# Altium project Altera_Array.PrjPCB
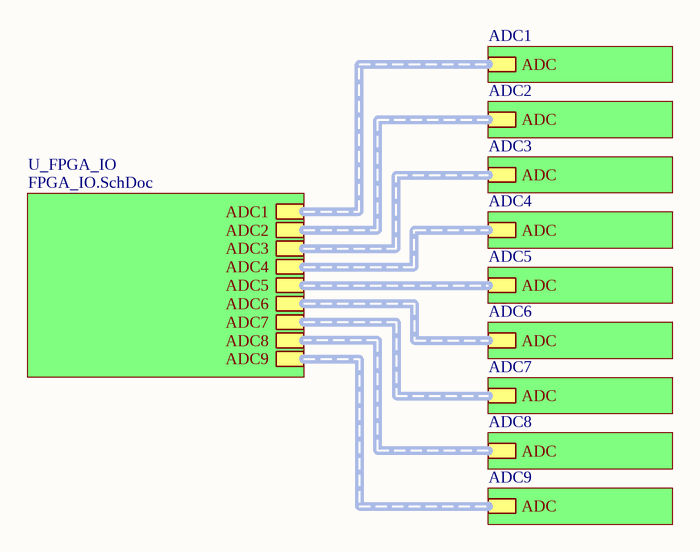
[diagram p0: Altera_Array_TOP.SchDoc]
3 sheets, 28 parts. Net scope: hierarchical (ports join the sheet entries above them; power ports are global).
Board file: Altera_Array.PcbDoc
Sheets:
  Altera_Array_TOP.SchDoc
    ADC1 = ADC_Connector.SchDoc
    ADC2 = ADC_Connector.SchDoc
    ADC3 = ADC_Connector.SchDoc
    ADC4 = ADC_Connector.SchDoc
    ADC5 = ADC_Connector.SchDoc
    ADC6 = ADC_Connector.SchDoc
    ADC7 = ADC_Connector.SchDoc
    ADC8 = ADC_Connector.SchDoc
    ADC9 = ADC_Connector.SchDoc
    U_FPGA_IO = FPGA_IO.SchDoc

## Sheet Altera_Array_TOP.SchDoc
size A

### Sub-sheets
ADC1 = ADC_Connector.SchDoc: ADC (harness ADC)
ADC2 = ADC_Connector.SchDoc: ADC (harness ADC)
ADC3 = ADC_Connector.SchDoc: ADC (harness ADC)
ADC4 = ADC_Connector.SchDoc: ADC (harness ADC)
ADC5 = ADC_Connector.SchDoc: ADC (harness ADC)
ADC6 = ADC_Connector.SchDoc: ADC (harness ADC)
ADC7 = ADC_Connector.SchDoc: ADC (harness ADC)
ADC8 = ADC_Connector.SchDoc: ADC (harness ADC)
ADC9 = ADC_Connector.SchDoc: ADC (harness ADC)
U_FPGA_IO = FPGA_IO.SchDoc: ADC1 (harness ADC), ADC4 (harness ADC), ADC8 (harness ADC), ADC5 (harness ADC), ADC9 (harness ADC), ADC2 (harness ADC), ADC3 (harness ADC), ADC7 (harness ADC), ADC6 (harness ADC)

### Buses and harness runs
harness sheet ADC1/ADC = sheet U_FPGA_IO/ADC1
harness sheet ADC2/ADC = sheet U_FPGA_IO/ADC2
harness sheet ADC3/ADC = sheet U_FPGA_IO/ADC3
harness sheet ADC4/ADC = sheet U_FPGA_IO/ADC4
harness sheet ADC5/ADC = sheet U_FPGA_IO/ADC5
harness sheet ADC6/ADC = sheet U_FPGA_IO/ADC6
harness sheet ADC7/ADC = sheet U_FPGA_IO/ADC7
harness sheet ADC8/ADC = sheet U_FPGA_IO/ADC8
harness sheet ADC9/ADC = sheet U_FPGA_IO/ADC9

## Sheet ADC_Connector.SchDoc
size A
Used 9 times, as channels ADC1, ADC2, ADC3, ADC4, ADC5, ADC6, ADC7, ADC8, ADC9. Parts and nets are listed once, with the designators drawn on the sheet.
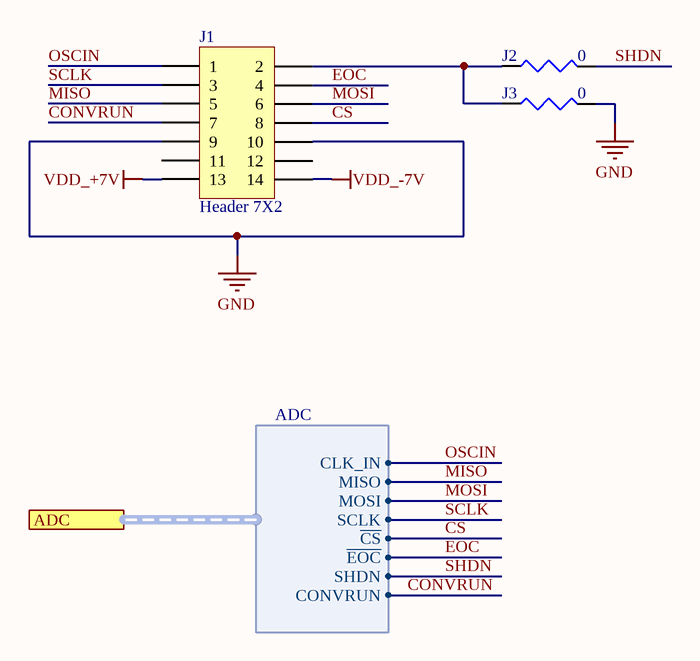
[diagram p1: ADC_Connector.SchDoc]

### Parts
J1  Header 7X2  [FLE-107-01-G-DV-A-TR]
J2  value 0  [J1-0603]  (hidden comment: Res3)
J3  value 0  [J1-0603]  (hidden comment: Res3)

### Ports
ADC (harness ADC)

### Harnesses
ADC: CLK_IN, MISO, MOSI, SCLK, ~{CS}, ~{EOC}, SHDN, CONVRUN

### Nets
GND: J1.9 J1.10 J3.2
VDD_+7V: J1.13
VDD_-7V: J1.14
~{CS}: J1.8 ; port ADC.~{CS}
CONVRUN: J1.7 ; port ADC.CONVRUN
~{EOC}: J1.4 ; port ADC.~{EOC}
MISO: J1.5 ; port ADC.MISO
MOSI: J1.6 ; port ADC.MOSI
OSCIN: J1.1 ; port ADC.CLK_IN
SCLK: J1.3 ; port ADC.SCLK
SHDN: J2.2 ; port ADC.SHDN
NetJ1_2: J1.2 J2.1 J3.1

Not connected (* = marked no-connect by the designer): J1 11 12

### Channels
ADC1: designators end in .A
ADC2: designators end in .B
ADC3: designators end in .C
ADC4: designators end in .D
ADC5: designators end in .E
ADC6: designators end in .F
ADC7: designators end in .G
ADC8: designators end in .H
ADC9: designators end in .I

### Library data of the parts
J1 = Header 7X2: Header, 7-Pin, Dual row; LatestRevisionDate: 17-Jul-2002; LatestRevisionNote: Re-released for DXP Platform.; Publisher: Altium Limited
J2 J3 = Res3: Resistor; Published: 8-Jun-2000; LatestRevisionDate: 29-May-2009; LatestRevisionNote: IPC-7351 Footprint Added.; PackageReference: J1-0603; Publisher: Altium Limited; PackageDescription: Chip Resistor

## Sheet FPGA_IO.SchDoc
size A2
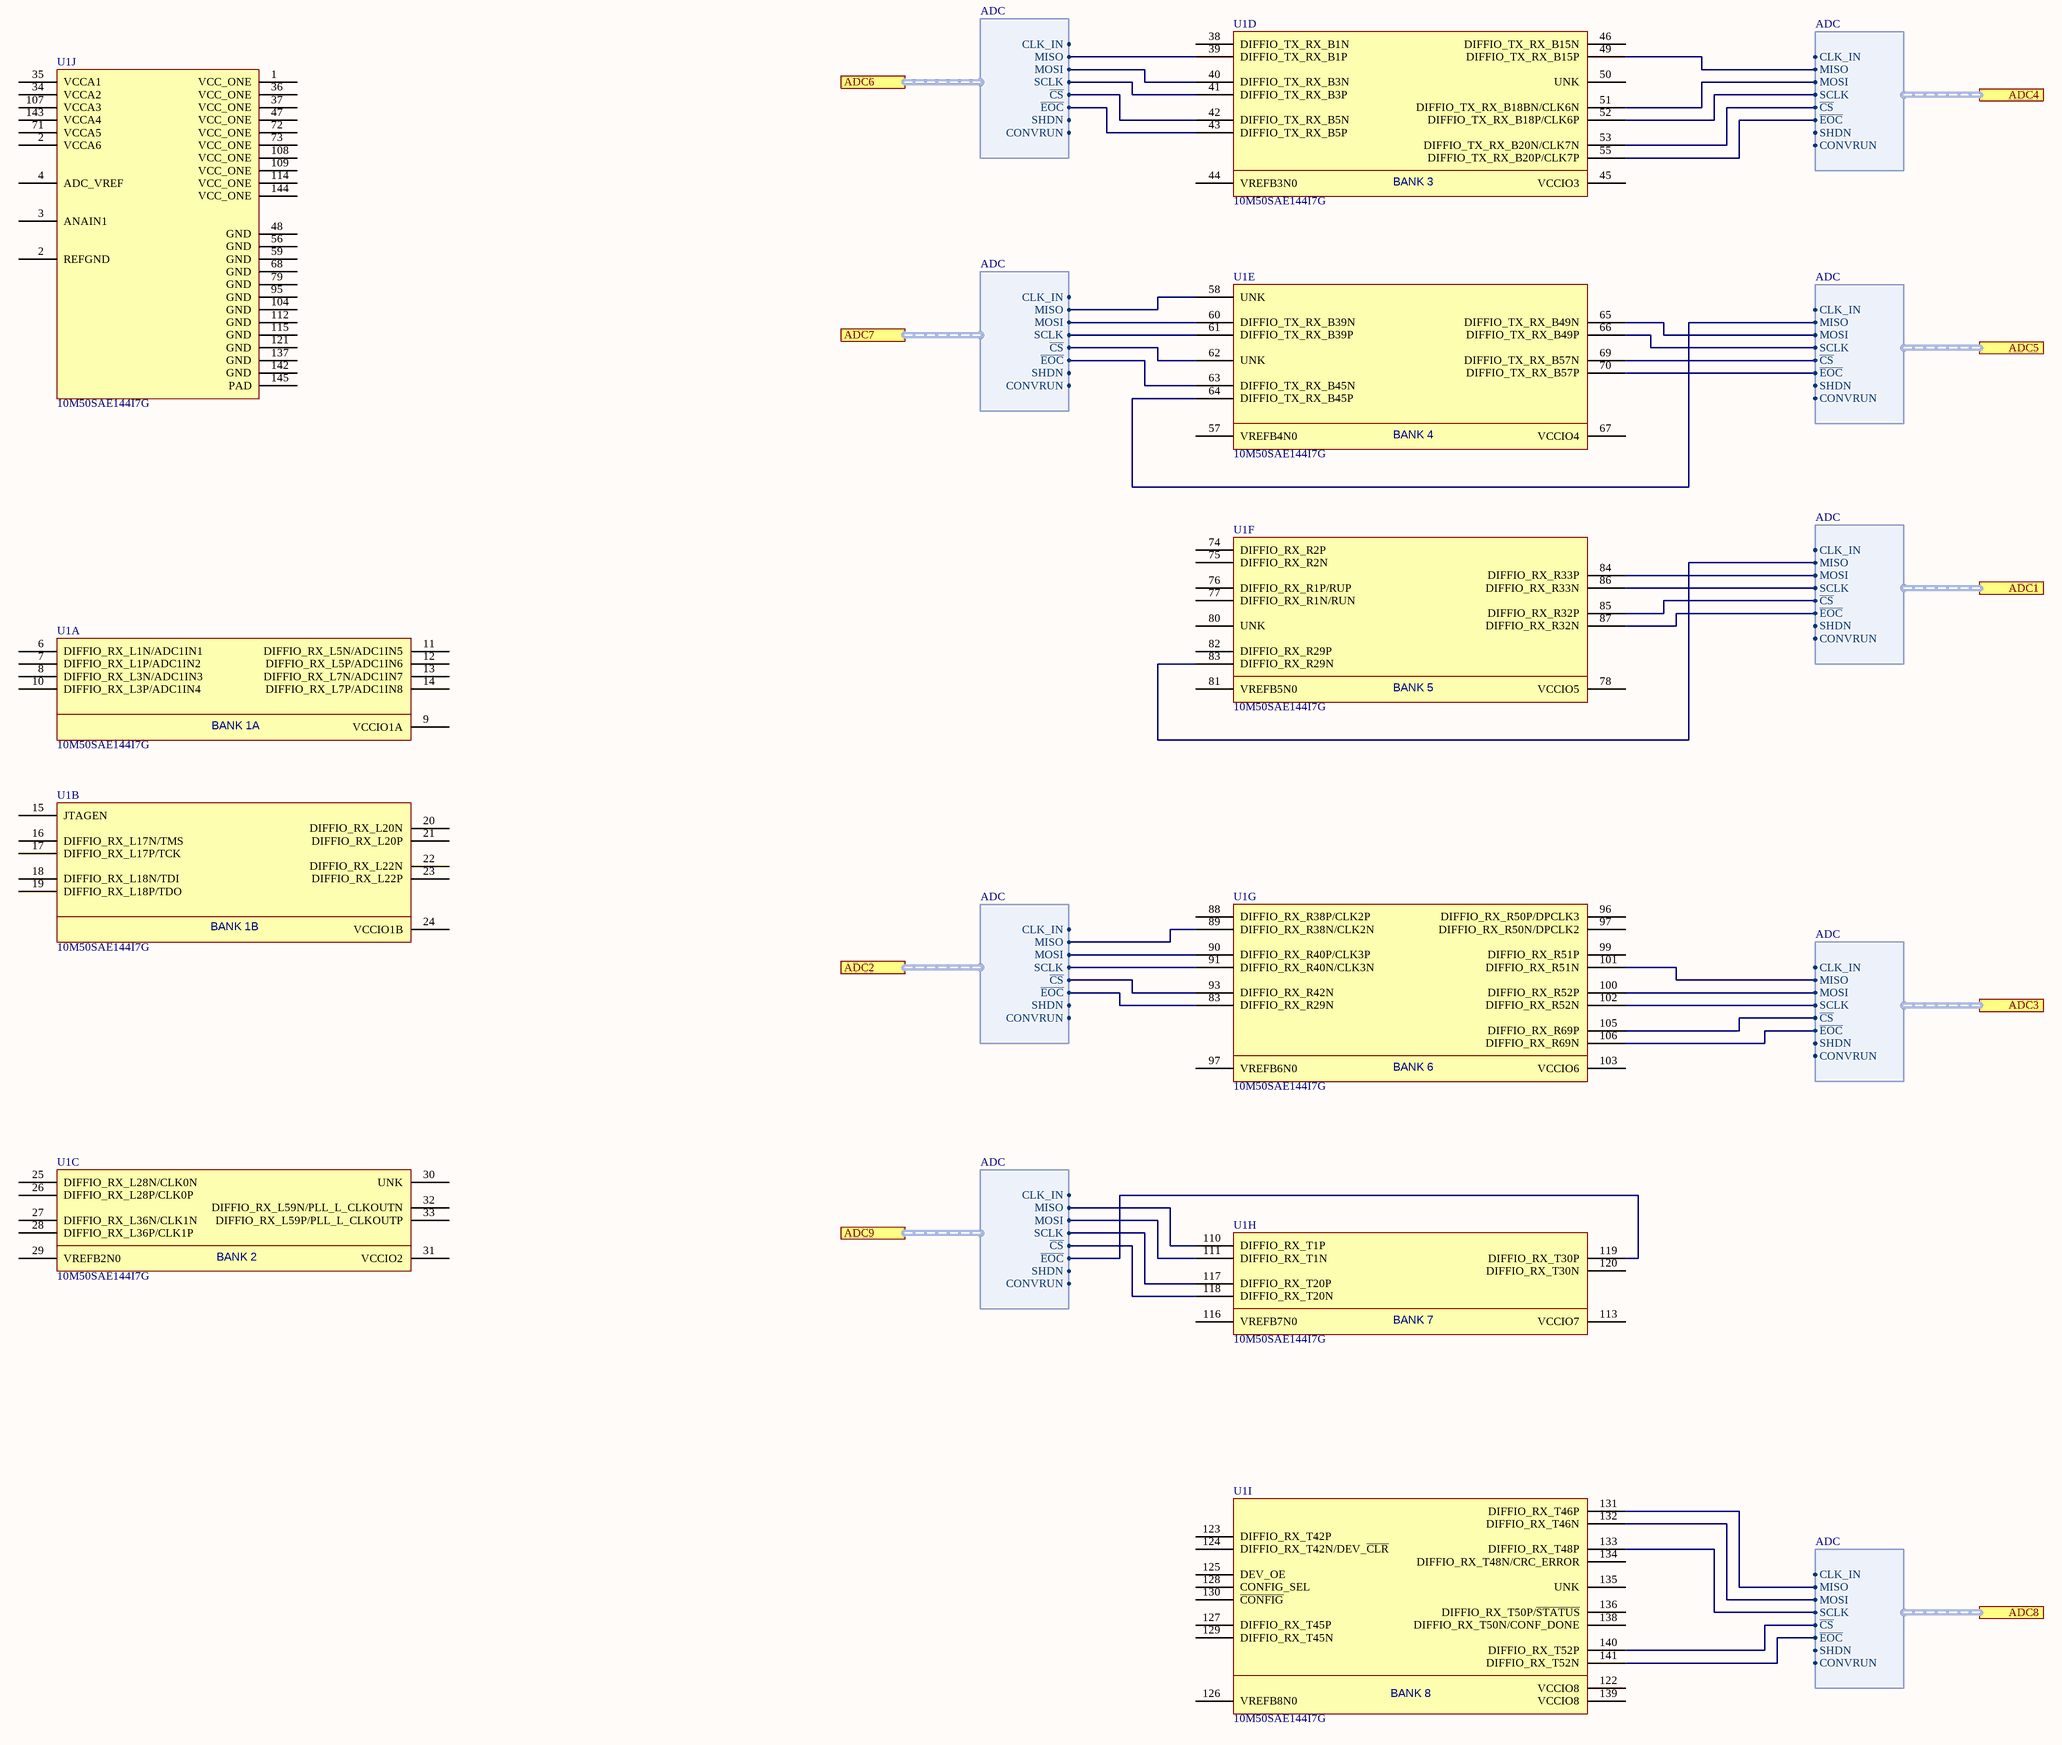
[diagram p2: FPGA_IO.SchDoc]

### Parts
U1  10M50SAE144I7G  [TSQFP50P2200X2200X160_HS-145N]  (parts A,B,C,D,E,F,G,H,I,J of 10)

### Ports
ADC1 (harness ADC), ADC2 (harness ADC), ADC3 (harness ADC), ADC4 (harness ADC), ADC5 (harness ADC), ADC6 (harness ADC), ADC7 (harness ADC), ADC8 (harness ADC), ADC9 (harness ADC)

### Harnesses
ADC: CLK_IN, MISO, MOSI, SCLK, ~{CS}, ~{EOC}, SHDN, CONVRUN

### Nets
~{CS}: U1.85(DIFFIO_RX_R32P) ; port ADC1.~{CS}
~{CS}: U1.93(DIFFIO_RX_R42N) ; port ADC2.~{CS}  [a separate net that carries the same name]
~{CS}: U1.105(DIFFIO_RX_R69P) ; port ADC3.~{CS}  [a separate net that carries the same name]
~{CS}: U1.53(DIFFIO_TX_RX_B20N/CLK7N) ; port ADC4.~{CS}  [a separate net that carries the same name]
~{CS}: U1.69(DIFFIO_TX_RX_B57N) ; port ADC5.~{CS}  [a separate net that carries the same name]
~{CS}: U1.42(DIFFIO_TX_RX_B5N) ; port ADC6.~{CS}  [a separate net that carries the same name]
~{CS}: U1.62(UNK) ; port ADC7.~{CS}  [a separate net that carries the same name]
~{CS}: U1.140(DIFFIO_RX_T52P) ; port ADC8.~{CS}  [a separate net that carries the same name]
~{CS}: U1.118(DIFFIO_RX_T20N) ; port ADC9.~{CS}  [a separate net that carries the same name]
~{EOC}: U1.87(DIFFIO_RX_R32N) ; port ADC1.~{EOC}
~{EOC}: U1.83(DIFFIO_RX_R29N) ; port ADC2.~{EOC}  [a separate net that carries the same name]
~{EOC}: U1.106(DIFFIO_RX_R69N) ; port ADC3.~{EOC}  [a separate net that carries the same name]
~{EOC}: U1.55(DIFFIO_TX_RX_B20P/CLK7P) ; port ADC4.~{EOC}  [a separate net that carries the same name]
~{EOC}: U1.70(DIFFIO_TX_RX_B57P) ; port ADC5.~{EOC}  [a separate net that carries the same name]
~{EOC}: U1.43(DIFFIO_TX_RX_B5P) ; port ADC6.~{EOC}  [a separate net that carries the same name]
~{EOC}: U1.63(DIFFIO_TX_RX_B45N) ; port ADC7.~{EOC}  [a separate net that carries the same name]
~{EOC}: U1.141(DIFFIO_RX_T52N) ; port ADC8.~{EOC}  [a separate net that carries the same name]
~{EOC}: U1.119(DIFFIO_RX_T30P) ; port ADC9.~{EOC}  [a separate net that carries the same name]
MISO: U1.83(DIFFIO_RX_R29N) ; port ADC1.MISO
MISO: U1.89(DIFFIO_RX_R38N/CLK2N) ; port ADC2.MISO  [a separate net that carries the same name]
MISO: U1.101(DIFFIO_RX_R51N) ; port ADC3.MISO  [a separate net that carries the same name]
MISO: U1.49(DIFFIO_TX_RX_B15P) ; port ADC4.MISO  [a separate net that carries the same name]
MISO: U1.64(DIFFIO_TX_RX_B45P) ; port ADC5.MISO  [a separate net that carries the same name]
MISO: U1.39(DIFFIO_TX_RX_B1P) ; port ADC6.MISO  [a separate net that carries the same name]
MISO: U1.58(UNK) ; port ADC7.MISO  [a separate net that carries the same name]
MISO: U1.131(DIFFIO_RX_T46P) ; port ADC8.MISO  [a separate net that carries the same name]
MISO: U1.110(DIFFIO_RX_T1P) ; port ADC9.MISO  [a separate net that carries the same name]
MOSI: U1.84(DIFFIO_RX_R33P) ; port ADC1.MOSI
MOSI: U1.90(DIFFIO_RX_R40P/CLK3P) ; port ADC2.MOSI  [a separate net that carries the same name]
MOSI: U1.100(DIFFIO_RX_R52P) ; port ADC3.MOSI  [a separate net that carries the same name]
MOSI: U1.51(DIFFIO_TX_RX_B18BN/CLK6N) ; port ADC4.MOSI  [a separate net that carries the same name]
MOSI: U1.65(DIFFIO_TX_RX_B49N) ; port ADC5.MOSI  [a separate net that carries the same name]
MOSI: U1.40(DIFFIO_TX_RX_B3N) ; port ADC6.MOSI  [a separate net that carries the same name]
MOSI: U1.60(DIFFIO_TX_RX_B39N) ; port ADC7.MOSI  [a separate net that carries the same name]
MOSI: U1.132(DIFFIO_RX_T46N) ; port ADC8.MOSI  [a separate net that carries the same name]
MOSI: U1.111(DIFFIO_RX_T1N) ; port ADC9.MOSI  [a separate net that carries the same name]
SCLK: U1.86(DIFFIO_RX_R33N) ; port ADC1.SCLK
SCLK: U1.91(DIFFIO_RX_R40N/CLK3N) ; port ADC2.SCLK  [a separate net that carries the same name]
SCLK: U1.102(DIFFIO_RX_R52N) ; port ADC3.SCLK  [a separate net that carries the same name]
SCLK: U1.52(DIFFIO_TX_RX_B18P/CLK6P) ; port ADC4.SCLK  [a separate net that carries the same name]
SCLK: U1.66(DIFFIO_TX_RX_B49P) ; port ADC5.SCLK  [a separate net that carries the same name]
SCLK: U1.41(DIFFIO_TX_RX_B3P) ; port ADC6.SCLK  [a separate net that carries the same name]
SCLK: U1.61(DIFFIO_TX_RX_B39P) ; port ADC7.SCLK  [a separate net that carries the same name]
SCLK: U1.133(DIFFIO_RX_T48P) ; port ADC8.SCLK  [a separate net that carries the same name]
SCLK: U1.117(DIFFIO_RX_T20P) ; port ADC9.SCLK  [a separate net that carries the same name]

Not connected (* = marked no-connect by the designer): U1 1(VCC_ONE) 2(VCCA6) 3(ANAIN1) 4(ADC_VREF) 6(DIFFIO_RX_L1N/ADC1IN1) 7(DIFFIO_RX_L1P/ADC1IN2) 8(DIFFIO_RX_L3N/ADC1IN3) 9(VCCIO1A) 10(DIFFIO_RX_L3P/ADC1IN4) 11(DIFFIO_RX_L5N/ADC1IN5) 12(DIFFIO_RX_L5P/ADC1IN6) 13(DIFFIO_RX_L7N/ADC1IN7) 14(DIFFIO_RX_L7P/ADC1IN8) 15(JTAGEN) 16(DIFFIO_RX_L17N/TMS) 17(DIFFIO_RX_L17P/TCK) 18(DIFFIO_RX_L18N/TDI) 19(DIFFIO_RX_L18P/TDO) 20(DIFFIO_RX_L20N) 21(DIFFIO_RX_L20P) 22(DIFFIO_RX_L22N) 23(DIFFIO_RX_L22P) 24(VCCIO1B) 25(DIFFIO_RX_L28N/CLK0N) 26(DIFFIO_RX_L28P/CLK0P) 27(DIFFIO_RX_L36N/CLK1N) 28(DIFFIO_RX_L36P/CLK1P) 29(VREFB2N0) 30(UNK) 31(VCCIO2) 32(DIFFIO_RX_L59N/PLL_L_CLKOUTN) 33(DIFFIO_RX_L59P/PLL_L_CLKOUTP) 34(VCCA2) 35(VCCA1) 36(VCC_ONE) 37(VCC_ONE) 38(DIFFIO_TX_RX_B1N) 44(VREFB3N0) 45(VCCIO3) 46(DIFFIO_TX_RX_B15N) 47(VCC_ONE) 48(GND) 50(UNK) 56(GND) 57(VREFB4N0) 59(GND) 67(VCCIO4) 68(GND) 71(VCCA5) 72(VCC_ONE) 73(VCC_ONE) 74(DIFFIO_RX_R2P) 75(DIFFIO_RX_R2N) 76(DIFFIO_RX_R1P/RUP) 77(DIFFIO_RX_R1N/RUN) 78(VCCIO5) 79(GND) 80(UNK) 81(VREFB5N0) 82(DIFFIO_RX_R29P) 88(DIFFIO_RX_R38P/CLK2P) 95(GND) 96(DIFFIO_RX_R50P/DPCLK3) 97(VREFB6N0) 99(DIFFIO_RX_R51P) 103(VCCIO6) 104(GND) 107(VCCA3) 108(VCC_ONE) 109(VCC_ONE) 112(GND) 113(VCCIO7) 114(VCC_ONE) 115(GND) 116(VREFB7N0) 120(DIFFIO_RX_T30N) 121(GND) 122(VCCIO8) 123(DIFFIO_RX_T42P) 124(DIFFIO_RX_T42N/DEV_~{CLR}) 125(DEV_OE) 126(VREFB8N0) 127(DIFFIO_RX_T45P) 128(CONFIG_SEL) 129(DIFFIO_RX_T45N) 130(~{CONFIG}) 134(DIFFIO_RX_T48N/CRC_ERROR) 135(UNK) 136(DIFFIO_RX_T50P/~{STATUS}) 137(GND) 138(DIFFIO_RX_T50N/CONF_DONE) 139(VCCIO8) 142(GND) 143(VCCA4) 144(VCC_ONE) 145(PAD)

### Notes on the sheet
- (in symbol 10M50SAE144I7G, part A) BANK 1A
- (in symbol 10M50SAE144I7G, part B) BANK 1B
- (in symbol 10M50SAE144I7G, part C) BANK 2
- (in symbol 10M50SAE144I7G, part D) BANK 3
- (in symbol 10M50SAE144I7G, part E) BANK 4
- (in symbol 10M50SAE144I7G, part F) BANK 5
- (in symbol 10M50SAE144I7G, part G) BANK 6
- (in symbol 10M50SAE144I7G, part H) BANK 7
- (in symbol 10M50SAE144I7G, part I) BANK 8

### Library data of the parts
U1 = 10M50SAE144I7G: IC FPGA 101 I/O 144EQFP

## Nets that join several sheets
GND: ADC1 (J1.A.9 J1.A.10 J3.A.2), ADC2 (J1.B.9 J1.B.10 J3.B.2), ADC3 (J1.C.9 J1.C.10 J3.C.2), ADC4 (J1.D.9 J1.D.10 J3.D.2), ADC5 (J1.E.9 J1.E.10 J3.E.2), ADC6 (J1.F.9 J1.F.10 J3.F.2), ADC7 (J1.G.9 J1.G.10 J3.G.2), ADC8 (J1.H.9 J1.H.10 J3.H.2), ADC9 (J1.I.9 J1.I.10 J3.I.2)
VDD_+7V: ADC1 (J1.A.13), ADC2 (J1.B.13), ADC3 (J1.C.13), ADC4 (J1.D.13), ADC5 (J1.E.13), ADC6 (J1.F.13), ADC7 (J1.G.13), ADC8 (J1.H.13), ADC9 (J1.I.13)
VDD_-7V: ADC1 (J1.A.14), ADC2 (J1.B.14), ADC3 (J1.C.14), ADC4 (J1.D.14), ADC5 (J1.E.14), ADC6 (J1.F.14), ADC7 (J1.G.14), ADC8 (J1.H.14), ADC9 (J1.I.14)
~{CS}: ADC1 (J1.A.8), FPGA_IO (U1.85)
~{CS}: ADC2 (J1.B.8), FPGA_IO (U1.93)
~{CS}: ADC3 (J1.C.8), FPGA_IO (U1.105)
~{CS}: ADC4 (J1.D.8), FPGA_IO (U1.53)
~{CS}: ADC5 (J1.E.8), FPGA_IO (U1.69)
~{CS}: ADC6 (J1.F.8), FPGA_IO (U1.42)
~{CS}: ADC7 (J1.G.8), FPGA_IO (U1.62)
~{CS}: ADC8 (J1.H.8), FPGA_IO (U1.140)
~{CS}: ADC9 (J1.I.8), FPGA_IO (U1.118)
~{EOC}: ADC1 (J1.A.4), FPGA_IO (U1.87)
~{EOC}: ADC2 (J1.B.4), FPGA_IO (U1.83)
~{EOC}: ADC3 (J1.C.4), FPGA_IO (U1.106)
~{EOC}: ADC4 (J1.D.4), FPGA_IO (U1.55)
~{EOC}: ADC5 (J1.E.4), FPGA_IO (U1.70)
~{EOC}: ADC6 (J1.F.4), FPGA_IO (U1.43)
~{EOC}: ADC7 (J1.G.4), FPGA_IO (U1.63)
~{EOC}: ADC8 (J1.H.4), FPGA_IO (U1.141)
~{EOC}: ADC9 (J1.I.4), FPGA_IO (U1.119)
MISO: ADC1 (J1.A.5), FPGA_IO (U1.83)
MISO: ADC2 (J1.B.5), FPGA_IO (U1.89)
MISO: ADC3 (J1.C.5), FPGA_IO (U1.101)
MISO: ADC4 (J1.D.5), FPGA_IO (U1.49)
MISO: ADC5 (J1.E.5), FPGA_IO (U1.64)
MISO: ADC6 (J1.F.5), FPGA_IO (U1.39)
MISO: ADC7 (J1.G.5), FPGA_IO (U1.58)
MISO: ADC8 (J1.H.5), FPGA_IO (U1.131)
MISO: ADC9 (J1.I.5), FPGA_IO (U1.110)
MOSI: ADC1 (J1.A.6), FPGA_IO (U1.84)
MOSI: ADC2 (J1.B.6), FPGA_IO (U1.90)
MOSI: ADC3 (J1.C.6), FPGA_IO (U1.100)
MOSI: ADC4 (J1.D.6), FPGA_IO (U1.51)
MOSI: ADC5 (J1.E.6), FPGA_IO (U1.65)
MOSI: ADC6 (J1.F.6), FPGA_IO (U1.40)
MOSI: ADC7 (J1.G.6), FPGA_IO (U1.60)
MOSI: ADC8 (J1.H.6), FPGA_IO (U1.132)
MOSI: ADC9 (J1.I.6), FPGA_IO (U1.111)
SCLK: ADC1 (J1.A.3), FPGA_IO (U1.86)
SCLK: ADC2 (J1.B.3), FPGA_IO (U1.91)
SCLK: ADC3 (J1.C.3), FPGA_IO (U1.102)
SCLK: ADC4 (J1.D.3), FPGA_IO (U1.52)
SCLK: ADC5 (J1.E.3), FPGA_IO (U1.66)
SCLK: ADC6 (J1.F.3), FPGA_IO (U1.41)
SCLK: ADC7 (J1.G.3), FPGA_IO (U1.61)
SCLK: ADC8 (J1.H.3), FPGA_IO (U1.133)
SCLK: ADC9 (J1.I.3), FPGA_IO (U1.117)